# EAGLE schematic platine-crocodile (EAGLE 9.6.2)
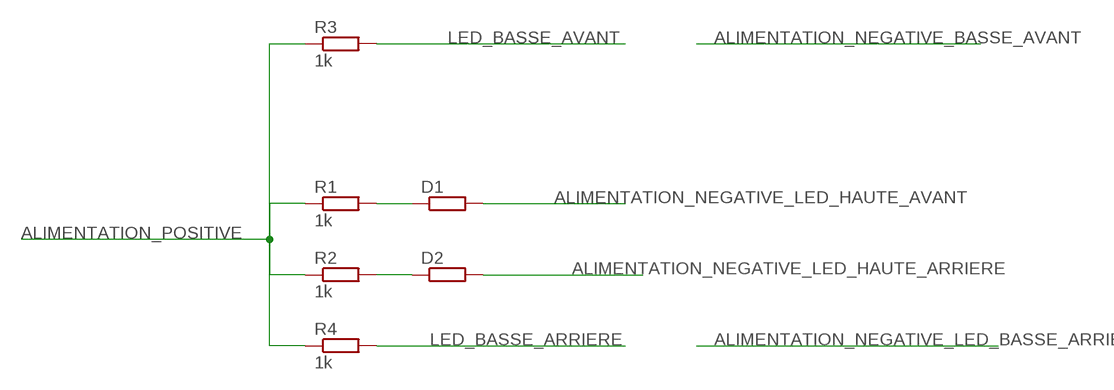
[diagram p0: schematic, sheet 1]

## Parts
D1  R-EU_M0805  [M0805]
D2  R-EU_M0805  [M0805]
R1  1k  R-EU_M1206  [M1206]
R2  1k  R-EU_M1206  [M1206]
R3  1k  R-EU_M1206  [M1206]
R4  1k  R-EU_M1206  [M1206]

## Nets
ALIMENTATION_NEGATIVE_LED_HAUTE_ARRIERE: D2.2
ALIMENTATION_NEGATIVE_LED_HAUTE_AVANT: D1.2
ALIMENTATION_POSITIVE: R1.1 R2.1 R3.1 R4.1
LED_BASSE_ARRIERE: R4.2
LED_BASSE_AVANT: R3.2
N$1: D1.1 R1.2
N$2: D2.1 R2.2

## Library data of the parts
D1 D2 R1-R4 = rcl:R-EU_: RESISTOR, European symbol; SPICEPREFIX: R